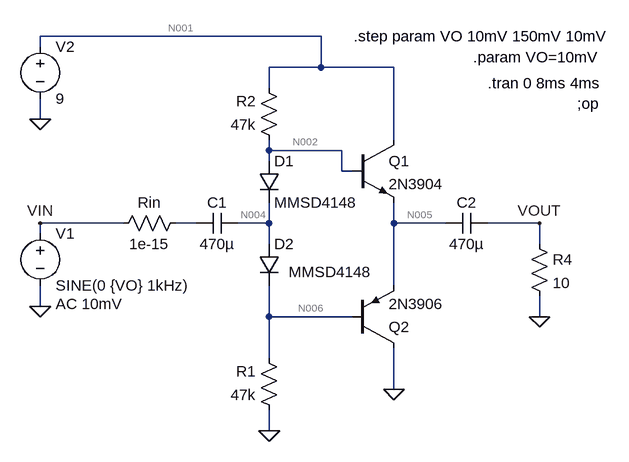
[diagram p0: schematic Figure_3.11.asc]
Figure_3.11.asc, the LTspice schematic file:
Version 4
SHEET 1 880 680
WIRE 240 -128 -192 -128
WIRE -192 -112 -192 -128
WIRE 240 -80 240 -128
WIRE 240 -80 160 -80
WIRE 352 -80 240 -80
WIRE 160 -48 160 -80
WIRE -192 0 -192 -32
WIRE 352 32 352 -80
WIRE 160 48 160 32
WIRE 272 48 160 48
WIRE 160 64 160 48
WIRE 272 80 272 48
WIRE 288 80 272 80
WIRE -64 160 -192 160
WIRE 48 160 16 160
WIRE 160 160 160 128
WIRE 160 160 112 160
WIRE 352 160 352 128
WIRE 432 160 352 160
WIRE 576 160 496 160
WIRE -192 176 -192 160
WIRE 160 192 160 160
WIRE 576 192 576 160
WIRE 352 256 352 160
WIRE -192 288 -192 256
WIRE 160 304 160 256
WIRE 288 304 160 304
WIRE 576 304 576 272
WIRE 160 368 160 304
WIRE 352 416 352 352
WIRE 160 480 160 448
FLAG 576 304 0
FLAG 160 480 0
FLAG 352 416 0
FLAG -192 288 0
FLAG 576 160 VOUT
FLAG -192 160 VIN
FLAG -192 0 0
SYMBOL diode 144 64 R0
SYMATTR InstName D1
SYMATTR Value MMSD4148
SYMBOL diode 144 192 R0
WINDOW 3 46 43 Left 2
SYMATTR InstName D2
SYMATTR Value MMSD4148
SYMBOL cap 112 144 R90
WINDOW 0 0 32 VBottom 2
WINDOW 3 32 32 VTop 2
SYMATTR InstName C1
SYMATTR Value 470µ
SYMBOL res 32 144 R90
WINDOW 0 0 56 VBottom 2
WINDOW 3 32 56 VTop 2
SYMATTR InstName Rin
SYMATTR Value 1e-15
SYMBOL res 176 464 R180
WINDOW 0 36 76 Left 2
WINDOW 3 36 40 Left 2
SYMATTR InstName R1
SYMATTR Value 47k
SYMBOL res 176 48 R180
WINDOW 0 36 76 Left 2
WINDOW 3 36 40 Left 2
SYMATTR InstName R2
SYMATTR Value 47k
SYMBOL npn 288 32 R0
SYMATTR InstName Q1
SYMATTR Value 2N3904
SYMBOL pnp 288 352 M180
SYMATTR InstName Q2
SYMATTR Value 2N3906
SYMBOL cap 496 144 R90
WINDOW 0 0 32 VBottom 2
WINDOW 3 32 32 VTop 2
SYMATTR InstName C2
SYMATTR Value 470µ
SYMBOL res 560 176 R0
SYMATTR InstName R4
SYMATTR Value 10
SYMBOL voltage -192 160 R0
WINDOW 123 24 124 Left 2
WINDOW 39 0 0 Left 2
SYMATTR InstName V1
SYMATTR Value SINE(0 {VO} 1kHz)
SYMATTR Value2 AC 10mV
SYMBOL voltage -192 -128 R0
WINDOW 123 0 0 Left 2
WINDOW 39 0 0 Left 2
SYMATTR InstName V2
SYMATTR Value 9
TEXT 634 -24 Left 2 !;op
TEXT 496 -56 Left 2 !.tran 0 8ms 4ms
TEXT 474 -96 Left 2 !.param VO=10mV
TEXT 290 -128 Left 2 !.step param VO 10mV 150mV 10mV

The netlist it stands for:
* Figure_3.11.asc
D1 N002 N004 MMSD4148
D2 N004 N006 MMSD4148
C1 N004 N003 470µ
Rin N003 VIN 1e-15
R1 0 N006 47k
R2 N002 N001 47k
Q1 N001 N002 N005 0 2N3904
Q2 0 N006 N005 0 2N3906
C2 VOUT N005 470µ
R4 VOUT 0 10
V1 VIN 0 SINE(0 {VO} 1kHz) AC 10mV
V2 N001 0 9
.model D D
.lib standard.dio
.model NPN NPN
.model PNP PNP
.lib standard.bjt
;op
.tran 0 8ms 4ms
.param VO=10mV
.step param VO 10mV 150mV 10mV
.backanno
.end

* Results of the author's LTspice run, read from the files saved beside the schematic
* Operating Point (first step), zero values left out:
*   vo = 10 m
*   V(n002) = 4.973 V
*   V(n004) = 4.5 V
*   V(n006) = 4.027 V
*   V(n001) = 9 V
*   V(n005) = 4.5 V
*   Ic(Q2) = -905.3 nA
*   Ib(Q2) = -4.348 nA
*   Ie(Q2) = 909.6 nA
*   Ic(Q1) = 906.7 nA
*   Ib(Q1) = 2.902 nA
*   Ie(Q1) = -909.6 nA
*   I(D2) = 85.68 µA
*   I(D1) = 85.68 µA
*   I(R2) = -85.68 µA
*   I(R1) = -85.68 µA
*   I(V2) = -86.59 µA
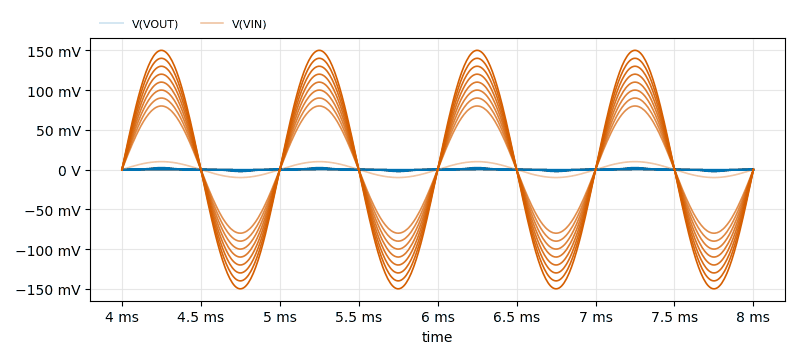
[diagram p1: Transient Analysis of Figure_3.11.asc, plotted from the saved traces]
* Transient Analysis, 29 runs:
*   V(VOUT) [run 1]: min -7.112 µV, max 7.112 µV, average -285.9 pV, rms 5.001 µV, last 14.91 nV
*   V(VOUT) [run 2]: 30.37 nV at time=4 ms, 30.37 nV at time=4 ms, min 30.37 nV, max 30.37 nV
*   V(VOUT) [run 3]: 41.02 nV at time=4 ms, 41.02 nV at time=4 ms, min 41.02 nV, max 41.02 nV
*   V(VOUT) [run 4]: 53.29 nV at time=4 ms, 53.29 nV at time=4 ms, min 53.29 nV, max 53.29 nV
*   V(VOUT) [run 5]: 68.48 nV at time=4 ms, 68.48 nV at time=4 ms, min 68.48 nV, max 68.48 nV
*   V(VOUT) [run 6]: 83.35 nV at time=4 ms, 83.35 nV at time=4 ms, min 83.35 nV, max 83.35 nV
*   V(VOUT) [run 7]: 98.27 nV at time=4 ms, 98.27 nV at time=4 ms, min 98.27 nV, max 98.27 nV
*   V(VOUT) [run 8]: 113.9 nV at time=4 ms, 113.9 nV at time=4 ms, min 113.9 nV, max 113.9 nV
*   V(VIN) [run 1]: min -9.991 mV, max 9.991 mV, average -54.11 nV, rms 7.068 mV, last 0 V
*   V(VIN) [run 2]: -0.01959 fV at time=4 ms, -0.01959 fV at time=4 ms, min -0.01959 fV, max -0.01959 fV
*   V(VIN) [run 3]: -0.02939 fV at time=4 ms, -0.02939 fV at time=4 ms, min -0.02939 fV, max -0.02939 fV
*   V(VIN) [run 4]: -0.03919 fV at time=4 ms, -0.03919 fV at time=4 ms, min -0.03919 fV, max -0.03919 fV
*   V(VIN) [run 5]: -0.04898 fV at time=4 ms, -0.04898 fV at time=4 ms, min -0.04898 fV, max -0.04898 fV
*   V(VIN) [run 6]: -0.05878 fV at time=4 ms, -0.05878 fV at time=4 ms, min -0.05878 fV, max -0.05878 fV
*   V(VIN) [run 7]: -0.06858 fV at time=4 ms, -0.06858 fV at time=4 ms, min -0.06858 fV, max -0.06858 fV
*   V(VIN) [run 8]: -0.07837 fV at time=4 ms, -0.07837 fV at time=4 ms, min -0.07837 fV, max -0.07837 fV